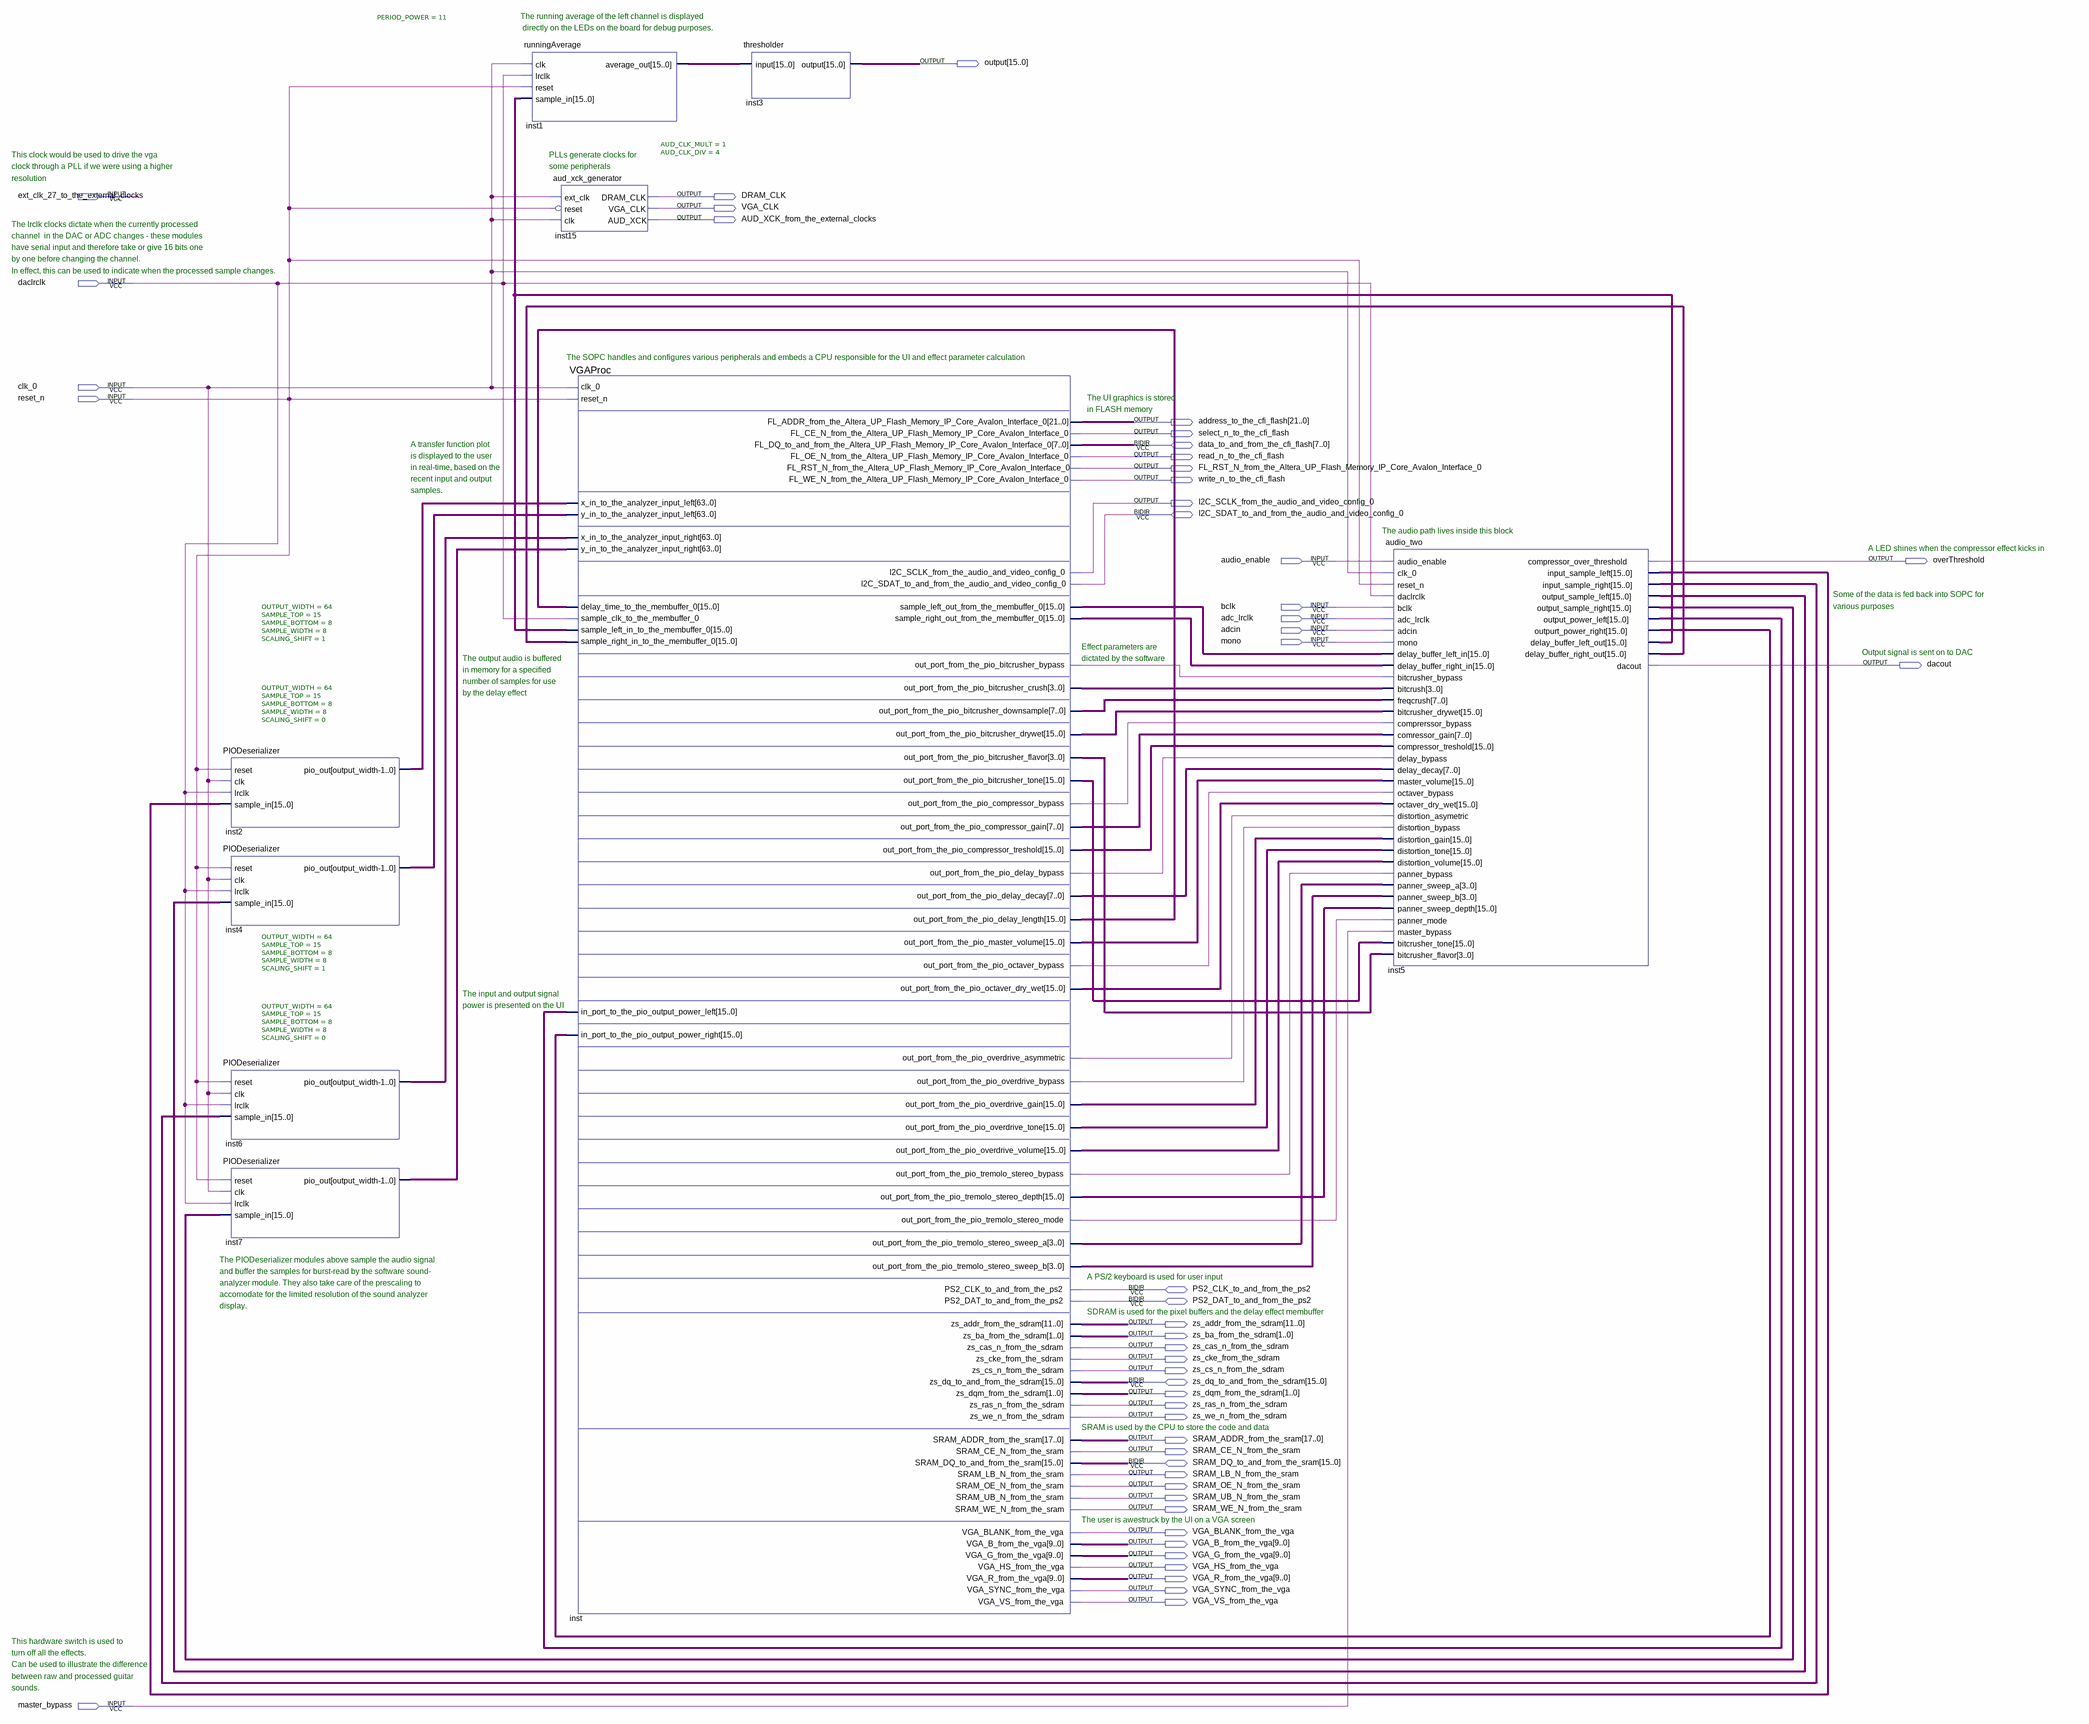
[diagram p0: schematic sheet]
// Quartus schematic DGN-1.bdf as structural Verilog: 9 symbols, 49 pins
module \DGN-1  (
  input  ext_clk_27_to_the_external_clocks,
  input  daclrclk,
  input  clk_0,
  input  reset_n,
  input  audio_enable,
  input  bclk,
  input  adc_lrclk,
  input  adcin,
  input  mono,
  input  master_bypass,
  inout  [7:0] data_to_and_from_the_cfi_flash,
  inout  I2C_SDAT_to_and_from_the_audio_and_video_config_0,
  inout  PS2_CLK_to_and_from_the_ps2,
  inout  PS2_DAT_to_and_from_the_ps2,
  inout  [15:0] zs_dq_to_and_from_the_sdram,
  inout  [15:0] SRAM_DQ_to_and_from_the_sram,
  output [15:0] \output ,
  output DRAM_CLK,
  output VGA_CLK,
  output AUD_XCK_from_the_external_clocks,
  output [21:0] address_to_the_cfi_flash,
  output select_n_to_the_cfi_flash,
  output read_n_to_the_cfi_flash,
  output FL_RST_N_from_the_Altera_UP_Flash_Memory_IP_Core_Avalon_Interface_0,
  output write_n_to_the_cfi_flash,
  output I2C_SCLK_from_the_audio_and_video_config_0,
  output overThreshold,
  output dacout,
  output [11:0] zs_addr_from_the_sdram,
  output [1:0] zs_ba_from_the_sdram,
  output zs_cas_n_from_the_sdram,
  output zs_cke_from_the_sdram,
  output zs_cs_n_from_the_sdram,
  output [1:0] zs_dqm_from_the_sdram,
  output zs_ras_n_from_the_sdram,
  output zs_we_n_from_the_sdram,
  output [17:0] SRAM_ADDR_from_the_sram,
  output SRAM_CE_N_from_the_sram,
  output SRAM_LB_N_from_the_sram,
  output SRAM_OE_N_from_the_sram,
  output SRAM_UB_N_from_the_sram,
  output SRAM_WE_N_from_the_sram,
  output VGA_BLANK_from_the_vga,
  output [9:0] VGA_B_from_the_vga,
  output [9:0] VGA_G_from_the_vga,
  output VGA_HS_from_the_vga,
  output [9:0] VGA_R_from_the_vga,
  output VGA_SYNC_from_the_vga,
  output VGA_VS_from_the_vga
);

  wire inst_out_port_from_the_pio_bitcrusher_bypass, inst_out_port_from_the_pio_compressor_bypass,
       inst_out_port_from_the_pio_delay_bypass, inst_out_port_from_the_pio_octaver_bypass,
       inst_out_port_from_the_pio_overdrive_asymmetric, inst_out_port_from_the_pio_overdrive_bypass,
       inst_out_port_from_the_pio_tremolo_stereo_bypass, inst_out_port_from_the_pio_tremolo_stereo_mode;
  wire [3:0] inst_out_port_from_the_pio_bitcrusher_crush, inst_out_port_from_the_pio_bitcrusher_flavor,
       inst_out_port_from_the_pio_tremolo_stereo_sweep_a, inst_out_port_from_the_pio_tremolo_stereo_sweep_b;
  wire [7:0] inst_out_port_from_the_pio_bitcrusher_downsample, inst_out_port_from_the_pio_compressor_gain,
       inst_out_port_from_the_pio_delay_decay;
  wire [15:0] inst1_average_out, inst5_delay_buffer_left_out, inst5_delay_buffer_right_out,
       inst5_input_sample_left, inst5_input_sample_right, inst5_outpurt_power_right, inst5_output_power_left,
       inst5_output_sample_left, inst5_output_sample_right, inst_out_port_from_the_pio_bitcrusher_drywet,
       inst_out_port_from_the_pio_bitcrusher_tone, inst_out_port_from_the_pio_compressor_treshold,
       inst_out_port_from_the_pio_delay_length, inst_out_port_from_the_pio_master_volume,
       inst_out_port_from_the_pio_octaver_dry_wet, inst_out_port_from_the_pio_overdrive_gain,
       inst_out_port_from_the_pio_overdrive_tone, inst_out_port_from_the_pio_overdrive_volume,
       inst_out_port_from_the_pio_tremolo_stereo_depth, inst_sample_left_out_from_the_membuffer_0,
       inst_sample_right_out_from_the_membuffer_0;
  wire [63:0] inst2_pio_out, inst4_pio_out, inst6_pio_out, inst7_pio_out;

  PIODeserializer #(.OUTPUT_WIDTH(64), .SAMPLE_TOP(15), .SAMPLE_BOTTOM(8), .SAMPLE_WIDTH(8), .SCALING_SHIFT(1)) inst2 (
    .reset(reset_n), .clk(clk_0), .lrclk(daclrclk), .sample_in(inst5_input_sample_left),
    .pio_out(inst2_pio_out));
  PIODeserializer #(.OUTPUT_WIDTH(64), .SAMPLE_TOP(15), .SAMPLE_BOTTOM(8), .SAMPLE_WIDTH(8), .SCALING_SHIFT(0)) inst4 (
    .reset(reset_n), .clk(clk_0), .lrclk(daclrclk), .sample_in(inst5_output_sample_left),
    .pio_out(inst4_pio_out));
  PIODeserializer #(.OUTPUT_WIDTH(64), .SAMPLE_TOP(15), .SAMPLE_BOTTOM(8), .SAMPLE_WIDTH(8), .SCALING_SHIFT(1)) inst6 (
    .reset(reset_n), .clk(clk_0), .lrclk(daclrclk), .sample_in(inst5_input_sample_right),
    .pio_out(inst6_pio_out));
  PIODeserializer #(.OUTPUT_WIDTH(64), .SAMPLE_TOP(15), .SAMPLE_BOTTOM(8), .SAMPLE_WIDTH(8), .SCALING_SHIFT(0)) inst7 (
    .reset(reset_n), .clk(clk_0), .lrclk(daclrclk), .sample_in(inst5_output_sample_right),
    .pio_out(inst7_pio_out));
  runningAverage #(.PERIOD_POWER(11)) inst1 (
    .clk(clk_0), .lrclk(daclrclk), .reset(reset_n), .sample_in(inst5_delay_buffer_left_out),
    .average_out(inst1_average_out));
  aud_xck_generator #(.AUD_CLK_MULT(1), .AUD_CLK_DIV(4)) inst15 (
    .ext_clk(clk_0), .reset(~reset_n), .clk(clk_0), .DRAM_CLK(DRAM_CLK), .VGA_CLK(VGA_CLK),
    .AUD_XCK(AUD_XCK_from_the_external_clocks));
  VGAProc inst (
    .clk_0(clk_0), .reset_n(reset_n), .x_in_to_the_analyzer_input_left(inst2_pio_out),
    .y_in_to_the_analyzer_input_left(inst4_pio_out), .x_in_to_the_analyzer_input_right(inst6_pio_out),
    .y_in_to_the_analyzer_input_right(inst7_pio_out),
    .delay_time_to_the_membuffer_0(inst_out_port_from_the_pio_delay_length),
    .sample_clk_to_the_membuffer_0(daclrclk),
    .sample_left_in_to_the_membuffer_0(inst5_delay_buffer_left_out),
    .sample_right_in_to_the_membuffer_0(inst5_delay_buffer_right_out),
    .in_port_to_the_pio_output_power_left(inst5_output_power_left),
    .in_port_to_the_pio_output_power_right(inst5_outpurt_power_right),
    .FL_ADDR_from_the_Altera_UP_Flash_Memory_IP_Core_Avalon_Interface_0(address_to_the_cfi_flash),
    .FL_CE_N_from_the_Altera_UP_Flash_Memory_IP_Core_Avalon_Interface_0(select_n_to_the_cfi_flash),
    .FL_OE_N_from_the_Altera_UP_Flash_Memory_IP_Core_Avalon_Interface_0(read_n_to_the_cfi_flash),
    .FL_RST_N_from_the_Altera_UP_Flash_Memory_IP_Core_Avalon_Interface_0(FL_RST_N_from_the_Altera_UP_Flash_Memory_IP_Core_Avalon_Interface_0),
    .FL_WE_N_from_the_Altera_UP_Flash_Memory_IP_Core_Avalon_Interface_0(write_n_to_the_cfi_flash),
    .I2C_SCLK_from_the_audio_and_video_config_0(I2C_SCLK_from_the_audio_and_video_config_0),
    .sample_left_out_from_the_membuffer_0(inst_sample_left_out_from_the_membuffer_0),
    .sample_right_out_from_the_membuffer_0(inst_sample_right_out_from_the_membuffer_0),
    .out_port_from_the_pio_bitcrusher_bypass(inst_out_port_from_the_pio_bitcrusher_bypass),
    .out_port_from_the_pio_bitcrusher_crush(inst_out_port_from_the_pio_bitcrusher_crush),
    .out_port_from_the_pio_bitcrusher_downsample(inst_out_port_from_the_pio_bitcrusher_downsample),
    .out_port_from_the_pio_bitcrusher_drywet(inst_out_port_from_the_pio_bitcrusher_drywet),
    .out_port_from_the_pio_bitcrusher_flavor(inst_out_port_from_the_pio_bitcrusher_flavor),
    .out_port_from_the_pio_bitcrusher_tone(inst_out_port_from_the_pio_bitcrusher_tone),
    .out_port_from_the_pio_compressor_bypass(inst_out_port_from_the_pio_compressor_bypass),
    .out_port_from_the_pio_compressor_gain(inst_out_port_from_the_pio_compressor_gain),
    .out_port_from_the_pio_compressor_treshold(inst_out_port_from_the_pio_compressor_treshold),
    .out_port_from_the_pio_delay_bypass(inst_out_port_from_the_pio_delay_bypass),
    .out_port_from_the_pio_delay_decay(inst_out_port_from_the_pio_delay_decay),
    .out_port_from_the_pio_delay_length(inst_out_port_from_the_pio_delay_length),
    .out_port_from_the_pio_master_volume(inst_out_port_from_the_pio_master_volume),
    .out_port_from_the_pio_octaver_bypass(inst_out_port_from_the_pio_octaver_bypass),
    .out_port_from_the_pio_octaver_dry_wet(inst_out_port_from_the_pio_octaver_dry_wet),
    .out_port_from_the_pio_overdrive_asymmetric(inst_out_port_from_the_pio_overdrive_asymmetric),
    .out_port_from_the_pio_overdrive_bypass(inst_out_port_from_the_pio_overdrive_bypass),
    .out_port_from_the_pio_overdrive_gain(inst_out_port_from_the_pio_overdrive_gain),
    .out_port_from_the_pio_overdrive_tone(inst_out_port_from_the_pio_overdrive_tone),
    .out_port_from_the_pio_overdrive_volume(inst_out_port_from_the_pio_overdrive_volume),
    .out_port_from_the_pio_tremolo_stereo_bypass(inst_out_port_from_the_pio_tremolo_stereo_bypass),
    .out_port_from_the_pio_tremolo_stereo_depth(inst_out_port_from_the_pio_tremolo_stereo_depth),
    .out_port_from_the_pio_tremolo_stereo_mode(inst_out_port_from_the_pio_tremolo_stereo_mode),
    .out_port_from_the_pio_tremolo_stereo_sweep_a(inst_out_port_from_the_pio_tremolo_stereo_sweep_a),
    .out_port_from_the_pio_tremolo_stereo_sweep_b(inst_out_port_from_the_pio_tremolo_stereo_sweep_b),
    .zs_addr_from_the_sdram(zs_addr_from_the_sdram), .zs_ba_from_the_sdram(zs_ba_from_the_sdram),
    .zs_cas_n_from_the_sdram(zs_cas_n_from_the_sdram), .zs_cke_from_the_sdram(zs_cke_from_the_sdram),
    .zs_cs_n_from_the_sdram(zs_cs_n_from_the_sdram), .zs_dqm_from_the_sdram(zs_dqm_from_the_sdram),
    .zs_ras_n_from_the_sdram(zs_ras_n_from_the_sdram), .zs_we_n_from_the_sdram(zs_we_n_from_the_sdram),
    .SRAM_ADDR_from_the_sram(SRAM_ADDR_from_the_sram), .SRAM_CE_N_from_the_sram(SRAM_CE_N_from_the_sram),
    .SRAM_LB_N_from_the_sram(SRAM_LB_N_from_the_sram), .SRAM_OE_N_from_the_sram(SRAM_OE_N_from_the_sram),
    .SRAM_UB_N_from_the_sram(SRAM_UB_N_from_the_sram), .SRAM_WE_N_from_the_sram(SRAM_WE_N_from_the_sram),
    .VGA_BLANK_from_the_vga(VGA_BLANK_from_the_vga), .VGA_B_from_the_vga(VGA_B_from_the_vga),
    .VGA_G_from_the_vga(VGA_G_from_the_vga), .VGA_HS_from_the_vga(VGA_HS_from_the_vga),
    .VGA_R_from_the_vga(VGA_R_from_the_vga), .VGA_SYNC_from_the_vga(VGA_SYNC_from_the_vga),
    .VGA_VS_from_the_vga(VGA_VS_from_the_vga),
    .FL_DQ_to_and_from_the_Altera_UP_Flash_Memory_IP_Core_Avalon_Interface_0(data_to_and_from_the_cfi_flash),
    .I2C_SDAT_to_and_from_the_audio_and_video_config_0(I2C_SDAT_to_and_from_the_audio_and_video_config_0),
    .PS2_CLK_to_and_from_the_ps2(PS2_CLK_to_and_from_the_ps2),
    .PS2_DAT_to_and_from_the_ps2(PS2_DAT_to_and_from_the_ps2),
    .zs_dq_to_and_from_the_sdram(zs_dq_to_and_from_the_sdram),
    .SRAM_DQ_to_and_from_the_sram(SRAM_DQ_to_and_from_the_sram));
  thresholder inst3 (.\input (inst1_average_out), .\output (\output ));
  audio_two inst5 (
    .audio_enable(audio_enable), .clk_0(clk_0), .reset_n(reset_n), .daclrclk(daclrclk), .bclk(bclk),
    .adc_lrclk(adc_lrclk), .adcin(adcin), .mono(mono),
    .delay_buffer_left_in(inst_sample_left_out_from_the_membuffer_0),
    .delay_buffer_right_in(inst_sample_right_out_from_the_membuffer_0),
    .bitcrusher_bypass(inst_out_port_from_the_pio_bitcrusher_bypass),
    .bitcrush(inst_out_port_from_the_pio_bitcrusher_crush),
    .freqcrush(inst_out_port_from_the_pio_bitcrusher_downsample),
    .bitcrusher_drywet(inst_out_port_from_the_pio_bitcrusher_drywet),
    .comprerssor_bypass(inst_out_port_from_the_pio_compressor_bypass),
    .comressor_gain(inst_out_port_from_the_pio_compressor_gain),
    .compressor_treshold(inst_out_port_from_the_pio_compressor_treshold),
    .delay_bypass(inst_out_port_from_the_pio_delay_bypass),
    .delay_decay(inst_out_port_from_the_pio_delay_decay),
    .master_volume(inst_out_port_from_the_pio_master_volume),
    .octaver_bypass(inst_out_port_from_the_pio_octaver_bypass),
    .octaver_dry_wet(inst_out_port_from_the_pio_octaver_dry_wet),
    .distortion_asymetric(inst_out_port_from_the_pio_overdrive_asymmetric),
    .distortion_bypass(inst_out_port_from_the_pio_overdrive_bypass),
    .distortion_gain(inst_out_port_from_the_pio_overdrive_gain),
    .distortion_tone(inst_out_port_from_the_pio_overdrive_tone),
    .distortion_volume(inst_out_port_from_the_pio_overdrive_volume),
    .panner_bypass(inst_out_port_from_the_pio_tremolo_stereo_bypass),
    .panner_sweep_a(inst_out_port_from_the_pio_tremolo_stereo_sweep_a),
    .panner_sweep_b(inst_out_port_from_the_pio_tremolo_stereo_sweep_b),
    .panner_sweep_depth(inst_out_port_from_the_pio_tremolo_stereo_depth),
    .panner_mode(inst_out_port_from_the_pio_tremolo_stereo_mode), .master_bypass(master_bypass),
    .bitcrusher_tone(inst_out_port_from_the_pio_bitcrusher_tone),
    .bitcrusher_flavor(inst_out_port_from_the_pio_bitcrusher_flavor),
    .compressor_over_threshold(overThreshold), .input_sample_left(inst5_input_sample_left),
    .input_sample_right(inst5_input_sample_right), .output_sample_left(inst5_output_sample_left),
    .output_sample_right(inst5_output_sample_right), .output_power_left(inst5_output_power_left),
    .outpurt_power_right(inst5_outpurt_power_right), .delay_buffer_left_out(inst5_delay_buffer_left_out),
    .delay_buffer_right_out(inst5_delay_buffer_right_out), .dacout(dacout));

  // Notes on the sheet:
  //   The running average of the left channel is displayed
  //    directly on the LEDs on the board for debug purposes.
  //   This clock would be used to drive the vga
  //   PLLs generate clocks for
  //   clock through a PLL if we were using a higher
  //   some peripherals
  //   resolution
  //   The lrclk clocks dictate when the currently processed
  //   channel  in the DAC or ADC changes - these modules
  //   have serial input and therefore take or give 16 bits one
  //   by one before changing the channel.
  //   In effect, this can be used to indicate when the processed sample changes.
  //   The SOPC handles and configures various peripherals and embeds a CPU responsible for the UI and effect parameter calculation
  //   The UI graphics is stored
  //   in FLASH memory
  //   A transfer function plot
  //   is displayed to the user
  //   in real-time, based on the
  //   recent input and output
  //   samples.
  //   The audio path lives inside this block
  //   A LED shines when the compressor effect kicks in
  //   Some of the data is fed back into SOPC for
  //   various purposes
  //   Effect parameters are
  //   Output signal is sent on to DAC
  //   The output audio is buffered
  //   dictated by the software
  //   in memory for a specified
  //   number of samples for use
  //   by the delay effect
  //   The input and output signal
  //   power is presented on the UI
  //   The PIODeserializer modules above sample the audio signal
  //   and buffer the samples for burst-read by the software sound-
  //   A PS/2 keyboard is used for user input
  //   analyzer module. They also take care of the prescaling to
  //   accomodate for the limited resolution of the sound analyzer
  //   display.
  //   SDRAM is used for the pixel buffers and the delay effect membuffer
  //   SRAM is used by the CPU to store the code and data
  //   The user is awestruck by the UI on a VGA screen
  //   This hardware switch is used to
  //   turn off all the effects.
  //   Can be used to illustrate the difference
  //   between raw and processed guitar
  //   sounds.
endmodule
